# Altium schematic sheet RF.SchDoc: Наименование
size 209 x 297 mm; ApprovedBy: Утвердил; CheckedBy: Проверил; Author: Разработал; CompanyName: Организация; DrawnBy: Н.Контр; Engineer: Т.Контр; SheetNumber: 1; SheetTotal: 1; PageSetup: Record=PageOptions|CenterHorizontal=True|CenterVertical=True|PrintScale=0.94|XCorrection=1.00|YCorrection=1.00|PrintKind=1|BorderSize=5000000|LeftOffset=0|BottomOffset=0|Orientation=1|PaperLength=1000|PaperWidth=1000|Scale=100|PaperSource=7|PrintQuality=-4|MediaType=1|DitherType=10|PaperKind=A4|PrintScaleMode=1; DecimalNumber: Децимальный номер; HeadOfSector: Нач. сектора; MainDevice: Перв.примен.; Name: Наименование; DocumentName: Sheet1.SCHDOC
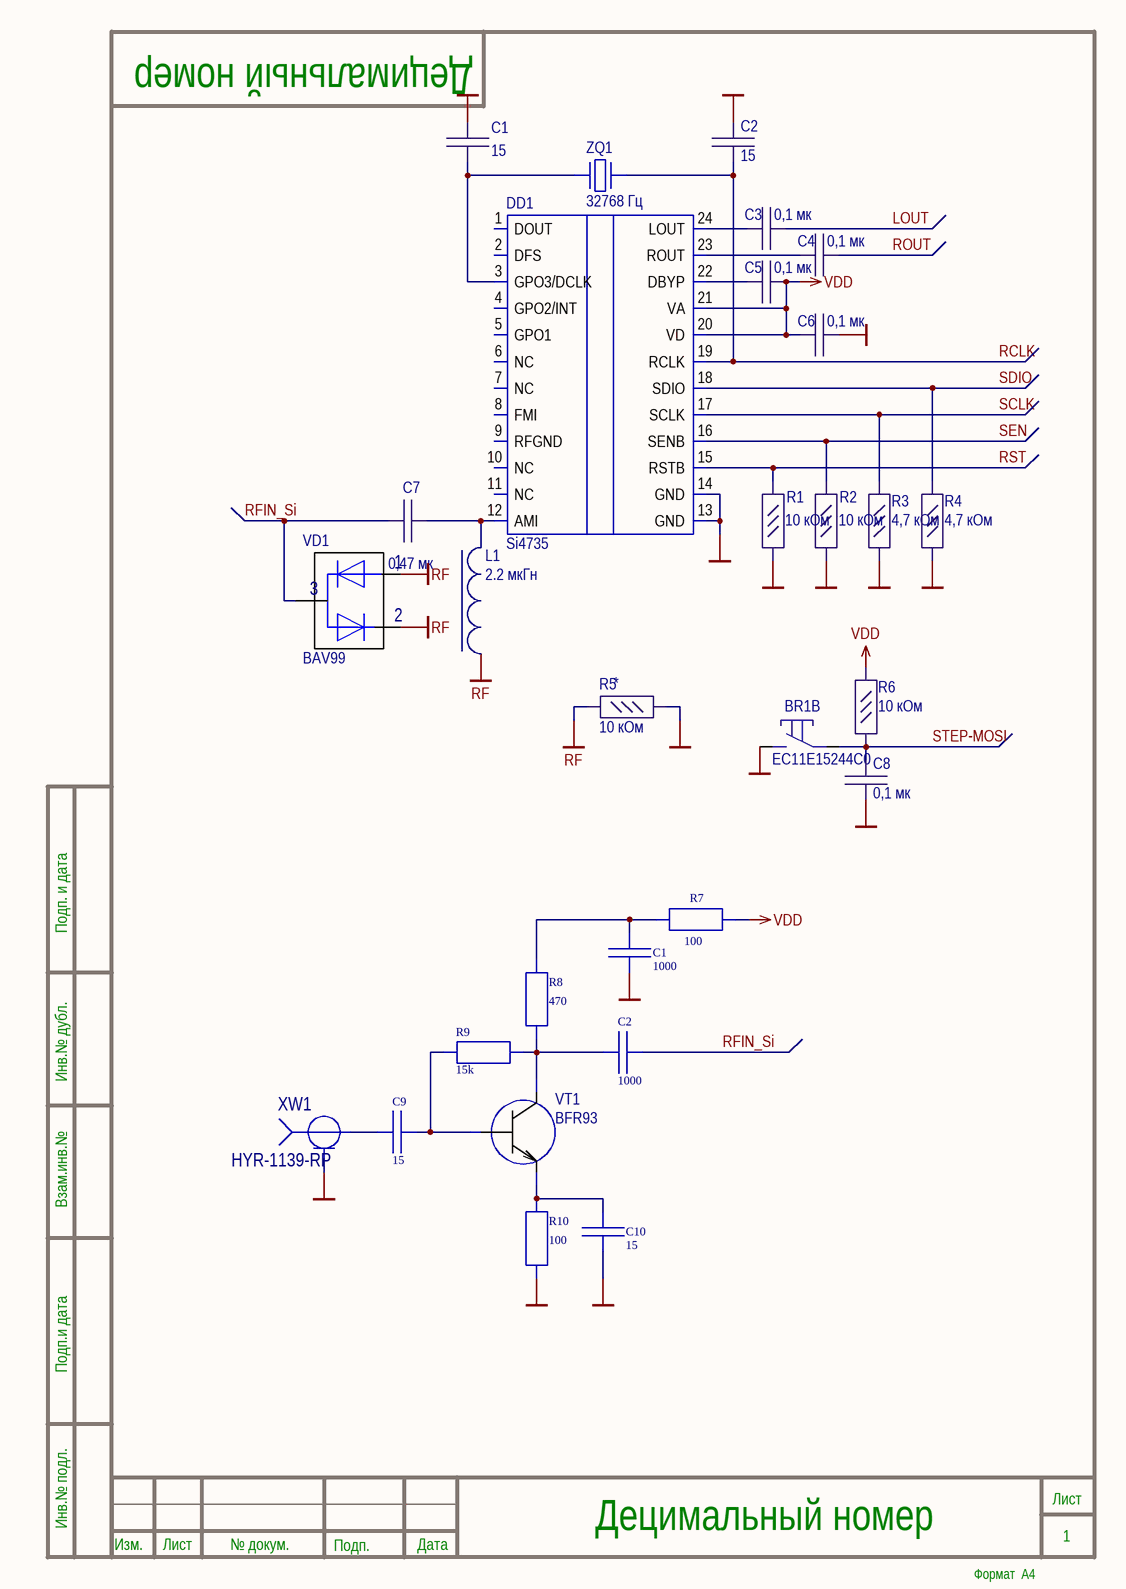
[diagram p0: RF.SchDoc]

## Parts
BR1  EC11E15244C0  [EC11]  (part B of 2)
C1  15  [C_0603]
C2  15  [C_0603]
C3  0,1 мк  [C_0603]
C4  0,1 мк  [C_0603]
C5  0,1 мк  [C_0603]
C6  0,1 мк  [C_0603]
C7  0,47 мк  [C_0603]
C8  0,1 мк  [C_0603]
C9  15  [C_0603]
C10  15  [C_0603]
DD1  Si4735  [SSOP-24]
L1  2.2 мкГн  [LQW18A]
R1  10 кОм  [R_0603]
R2  10 кОм  [R_0603]
R3  4,7 кОм  [R_0603]
R4  4,7 кОм  [R_0603]
R5  10 кОм  [R_0603]
R6  10 кОм  [R_0603]
R7  100  [R_0603]
R8  470  [R_0603]
R9  15k  [R_0603]
R10  100  [R_0603]
VD1  BAV99  [SOT23]
VT1  BFR93  [BFR93 SOT95P230X110-3L]
XW1  HYR-1139-RP  [SMA (HYR1139)]
ZQ1  32768 Гц  [DT-38T]
С1  1000  [C_0603]
С2  1000  [C_0603]

## Nets
GND: BR1.D C1.2 C2.2 C6.1 C8.2 C10.1 DD1.13(GND) DD1.14(GND) R1.1 R2.1 R3.1 R4.1 R5.1 R10.1 XW1.1 С1.1
RF: L1.1 R5.2 VD1.1(A1) VD1.2(C2)
VDD: C5.1 C6.2 DD1.20(VD) DD1.21(VA) R6.1 R7.2
LOUT: C3.1
RCLK: C2.1 DD1.19(RCLK) ZQ1.1
RFIN_Si: C7.1 VD1.3(C1A2) С2.1
ROUT: C4.1
RST: DD1.15(RSTB) R1.2
SCLK: DD1.17(SCLK) R3.2
SDIO: DD1.18(SDIO) R4.2
SEN: DD1.16(SENB) R2.2
STEP-MOSI: BR1.E C8.1 R6.2
NetC1_1: C1.1 DD1.3(GPO3/DCLK) ZQ1.2
NetC3_2: C3.2 DD1.24(LOUT)
NetC4_2: C4.2 DD1.23(ROUT)
NetC5_2: C5.2 DD1.22(DBYP)
NetC7_2: C7.2 DD1.12(AMI) L1.2
NetC9_1: C9.1 XW1.2
NetC9_2: C9.2 R9.1 VT1.1(B)
NetC10_2: C10.2 R10.2 VT1.2(E)
NetR7_1: R7.1 R8.2 С1.2
NetR8_1: R8.1 R9.2 VT1.3(C) С2.2

Not connected (* = marked no-connect by the designer): DD1 1(DOUT) 2(DFS) 4(GPO2/INT) 5(GPO1) 6(NC) 7(NC) 8(FMI) 9(RFGND) 10(NC) 11(NC)

## Notes on the sheet
- (near R5) *
- Подп. и дата
- Инв.№ дубл.
- Взам.инв.№
- Подп.и дата
- Инв.№ подл.
- Изм.
- Лист
- № докум.
- Подп.
- Дата
- Формат  A4

## Library data of the parts
C1 C2 = GRM1885C1H150FA01D: CAP CER 15PF 50V C0G/NP0 0603; Manufacturer: Murata Electronics; Part Number: GRM1885C1H150FA01D; Value: 15pF; ComponentLink1URL: https://www.murata.com/~/media/webrenewal/support/library/catalog/products/capacitor/mlcc/c02e.ashx?la=en-us; ComponentLink1Description: Datasheet; Component Type: Capasitor
C3-C6 C8 = GRM188R72A104MA35D: CAP CER 0.1UF 100V X7R 0603; Manufacturer: Murata Electronics; Value: 0.1µF; Part Number: GRM188R72A104MA35D; ComponentLink1URL: https://search.murata.co.jp/Ceramy/image/img/A01X/G101/ENG/GRM188R72A104MA35-01.pdf; ComponentLink1Description: Datasheet; Component Type: Capasitor
C7 = GRM188R71E474KA12D: CAP CER 0.47UF 25V X7R 0603; Manufacturer: Murata Electronics; Value: 0.47µF; Part Number: GRM188R71E474KA12D; ComponentLink1URL: https://www.murata.com/~/media/webrenewal/support/library/catalog/products/capacitor/mlcc/c02e.ashx?la=en-us; ComponentLink1Description: Datasheet; Component Type: Capasitor
C9 C10 = 06035C100KAT2A: Cap. 15 pF, 0603
DD1 = Si4735: BROADCAST AM/FM/SW/LW RADIO RECEIVER
L1 = LQW18ANR22G: 0.22 мкГн, 0603, 2%
R1 R2 R5 R6 = CR0603-FX-1002ELF: RES SMD 10K OHM 1% 1/10W 0603; Manufacturer: Bourns Inc.; Part Number: CR0603-FX-1002ELF; Value: 10 кОм; ComponentLink1URL: https://www.bourns.com/pdfs/chpreztr.pdf; ComponentLink1Description: Datasheet; Component Type: Resistor
R3 R4 = CR0603-FX-4701ELF: RES SMD 4.7K OHM 1% 1/10W 0603; Manufacturer: Bourns Inc.; Part Number: CR0603-FX-4701ELF; Value: 4,7 кОм; ComponentLink1URL: https://www.bourns.com/pdfs/chpreztr.pdf; ComponentLink1Description: Datasheet; Component Type: Resistor
R7 R10 = CR0603-FX-1000ELF: Res. 100 Ohm, 0603
R8 = RC0603JR-07470RL: Res. 470 Ohm, 0603
R9 = RC0603FR-0715KL: Res. 15 kOhm, 0603
ZQ1 = FTX32.768K12.5D8-20D
С1 С2 = 06035A102JAT2A: Cap. 1000nF, 0603
VD1 = BAV99: HelpURL: https://www.vishay.com/docs/85718/bav99.pdf